# EAGLE schematic filtr (EAGLE 6.5.0)
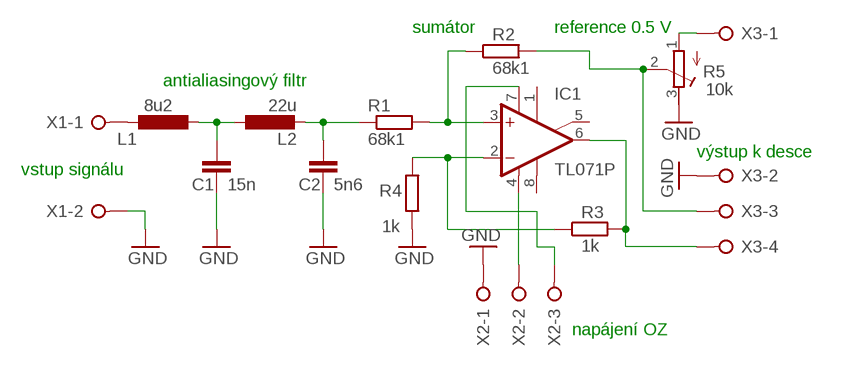
[diagram p0: schematic, sheet 1]

## Parts
C1  15n  C-EU025-030X050  [C025-030X050]
C2  5n6  C-EU025-030X050  [C025-030X050]
IC1  TL071P  [DIL08]
L1  8u2  L-EU0207/12  [0207/12]
L2  22u  L-EU0207/12  [0207/12]
R1  68k1  R-EU_0207/12  [0207/12]
R2  68k1  R-EU_0207/12  [0207/12]
R3  1k  R-EU_0207/12  [0207/12]
R4  1k  R-EU_0207/12  [0207/12]
R5  10k  R-TRIMM3296W  [RTRIM3296W]
X1  W237-02P  [W237-132]
X2  W237-3E  [W237-3E]
X3  W237-04P  [W237-4P]

## Nets
GND: C1.2 C2.2 R4.1 R5.3(E) X1.2 X2.1 X3.2
N$1: L1.1 X1.1
N$2: C1.1 L1.2 L2.1
N$3: C2.1 L2.2 R1.1
N$4: IC1.3(+IN) R1.2 R2.1
N$5: IC1.2(-IN) R3.1 R4.2
N$6: IC1.4(V-) X2.2
N$7: IC1.7(V+) X2.3
N$8: IC1.6(OUT) R3.2 X3.4
N$9: R2.2 R5.2(S) X3.3
N$10: R5.1(A) X3.1
Unconnected: IC1.1(ON1) IC1.5(ON2) IC1.8(OPT)

## Notes on the sheet
- sumátor | reference 0.5 V
- antialiasingový filtr
- výstup k desce
- vstup signálu
- napájení OZ

## Library data of the parts
C1 C2 = rcl:C-EU: CAPACITOR, European symbol
IC1 = linear:TL071: OP AMP
L1 L2 = rcl:L-EU: INDUCTOR, European symbol
R1-R4 = rcl:R-EU_: RESISTOR, European symbol
R5 = rcl:R-TRIMM: Trimm resistor
X1 = con-wago-508:W237-02P: WAGO SREW CLAMP; OC_FARNELL: unknown; OC_NEWARK: unknown
X2 = con-wago-508:W237-3E: WAGO SREW CLAMP; OC_FARNELL: unknown; OC_NEWARK: unknown
X3 = con-wago-508:W237-04P: WAGO SREW CLAMP; OC_FARNELL: unknown; OC_NEWARK: unknown